# Altium schematic sheet LaserTagJoystickBoard.SchDoc
size A; SheetNumber: 4; SheetTotal: 4
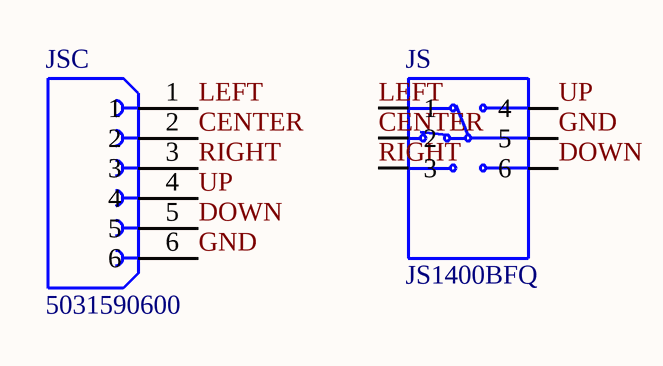
[diagram p0: LaserTagJoystickBoard.SchDoc]

## Parts
JS  JS1400BFQ  [SW_JS1400BFQ]
JSC  5031590600  [MOLEX_5031590600]

## Nets
CENTER: JS.2 JSC.2
DOWN: JS.6 JSC.5
GND: JS.5 JSC.6
LEFT: JS.1 JSC.1
RIGHT: JS.3 JSC.3
UP: JS.4 JSC.4

Not connected (* = marked no-connect by the designer): JS SH1(SHIELD) SH2(SHIELD)

## Library data of the parts
JS = JS1400BFQ: Navigation Switch, 2 - Axis Digital (Mechanical Switch) Output; MF: E-Switch; Digi-Key_Part_Number: EG5858-ND; MP: JS1400BFQ; Value: *; SnapEDA_Link: https://www.snapeda.com/parts/JS1400BFQ/E-Switch/view-part/2768291/?ref=snap; Package: None
JSC = 5031590600: 1.50mm Pitch, CLIK-Mate PCB Receptacle, Single Row, Through Hole, Vertical, Tin Plating, Positive Lock, with Peg, 6 Circuits, Natural; Price: None; Availability: Unavailable; Value: *; MP: 5031590600; Package: None